# Altium schematic sheet 09-RF_SUBG.SchDoc
size C; SheetNumber: 9; SheetTotal: 12; SPICEModelCacheYEUHMWUF: <root> / <DocumentId>YEUHMWUF</DocumentId> / <CacheFrame Number="0"> / <Model Name="umk105bj104_v-f" Kind="CKT"> / <Text>* UMK105BJ104_V-F     SPICE MODEL  ( General Type ) / *-------------------------------------------------------------------------------------------------------- / * Model Generated by TAIYO YUDEN Corporation (http://www.ty-top.com) / * Version 1.0 / * TAIYO YUDEN Control No. 170508_120810 / * Copyright(c) 2012 TAIYO YUDEN CO.,LTD. All Rights Reserved. / *-------------------------------------------------------------------------------------------------------- / * / * Products Name : Multilayer Ceramic Capacitors / * / * Characteristics : / *     Capacitance : 0.1 uF , Rated Voltage : 50V , TCC : X5R / *     Case Size : 1.0 x 0.5 / 0.039 x 0.02 [mm/inch] , Thickness : 0.5 / 0.02 [mm/inch] / *     (Conditions: Temperature = 25 degC , DC Bias Current/Voltage = 0A / 0V) / * / * Frequency Range : 40Hz - 3GHz / * / * External Node Assignments : / * / *  1  o---| |---o  2 / * / *-------------------------------------------------------------------------------------------------------- / .SubCkt UMK105BJ104_V-F 1 2 / **************************** / C0 1 110 0.068998u / Cm 1 101 0.01292u / C1 101 102 0.041907u / Rc1 101 102 25.432k / C2 102 103 0.021417u / Rc2 102 103 1.1926k / C3 103 110 0.016759u / Rc3 103 110 12.415 / C2m 1 301 0.022631u / C21 301 302 0.1608u / Rc21 301 302 202.11k / C22 302 303 0.054305u / Rc22 302 303 87.274k / C23 303 304 0.14296u / Rc23 303 304 7.7387k / C24 304 305 0.08092u / Rc24 304 305 2.9339k / C25 305 306 0.04951u / Rc25 305 306 2.1733k / C26 306 307 0.043691u / Rc26 306 307 191.91 / C27 307 308 0.016759u / Rc27 307 308 147.23 / C28 308 309 5027.4p / Rc28 308 309 97.746 / C29 309 110 570.66p / Rc29 309 110 12.365 / Rp0 1 110 5G / L0 110 120 0.23341n / Lm 120 130 0.14222n / L1 120 121 0.036554n / RL1 121 130 1.698 / L2 120 122 0.11188n / RL2 122 130 0.33926 / L3 120 123 1.1401n / RL3 123 130 1.655 / CR 120 124 0.028892u / LR 124 125 0.10347n / RR 125 130 0.14446 / CL 130 140 2.048p / LL 130 140 0.1545n / RL 130 140 189.66 / Rs 140 2 26.069m / **************************** / .ends UMK105BJ104_V-F</Text> / </Model> / </CacheFrame> / </root>
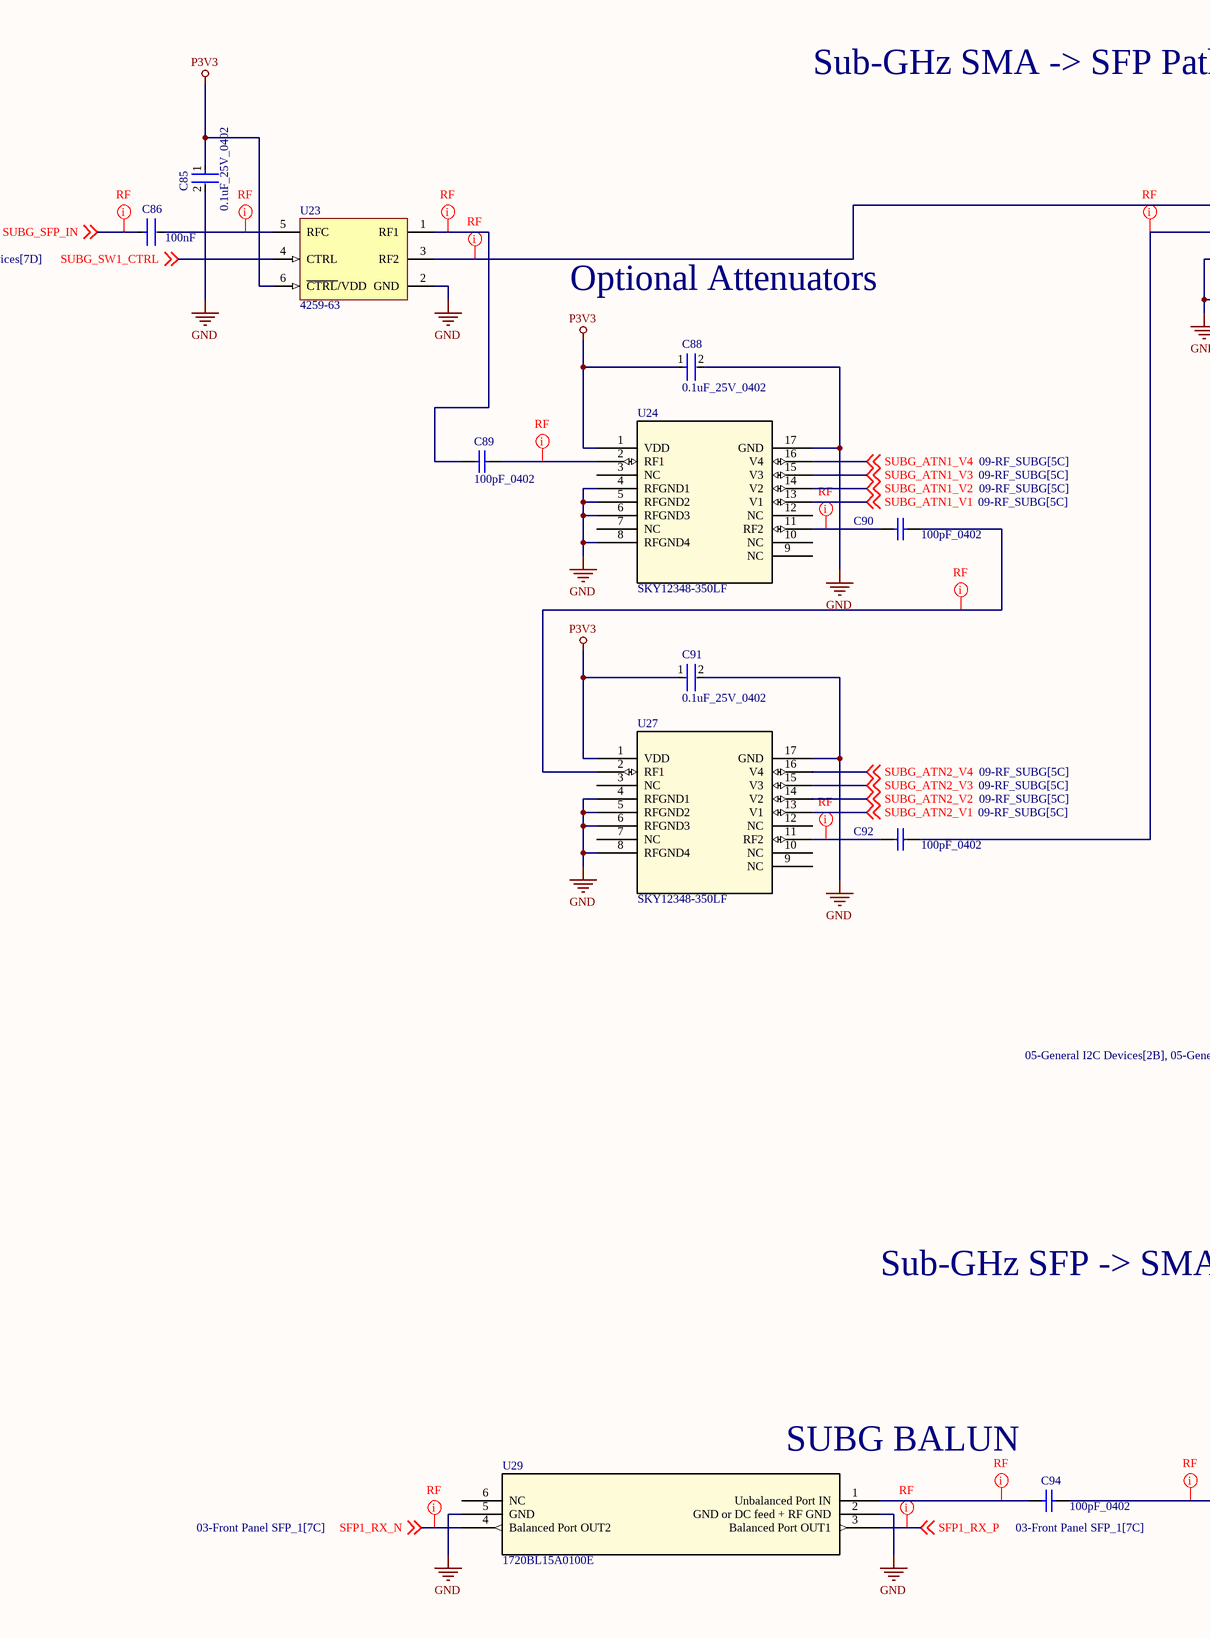
[diagram p0: 09-RF_SUBG.SchDoc, left]
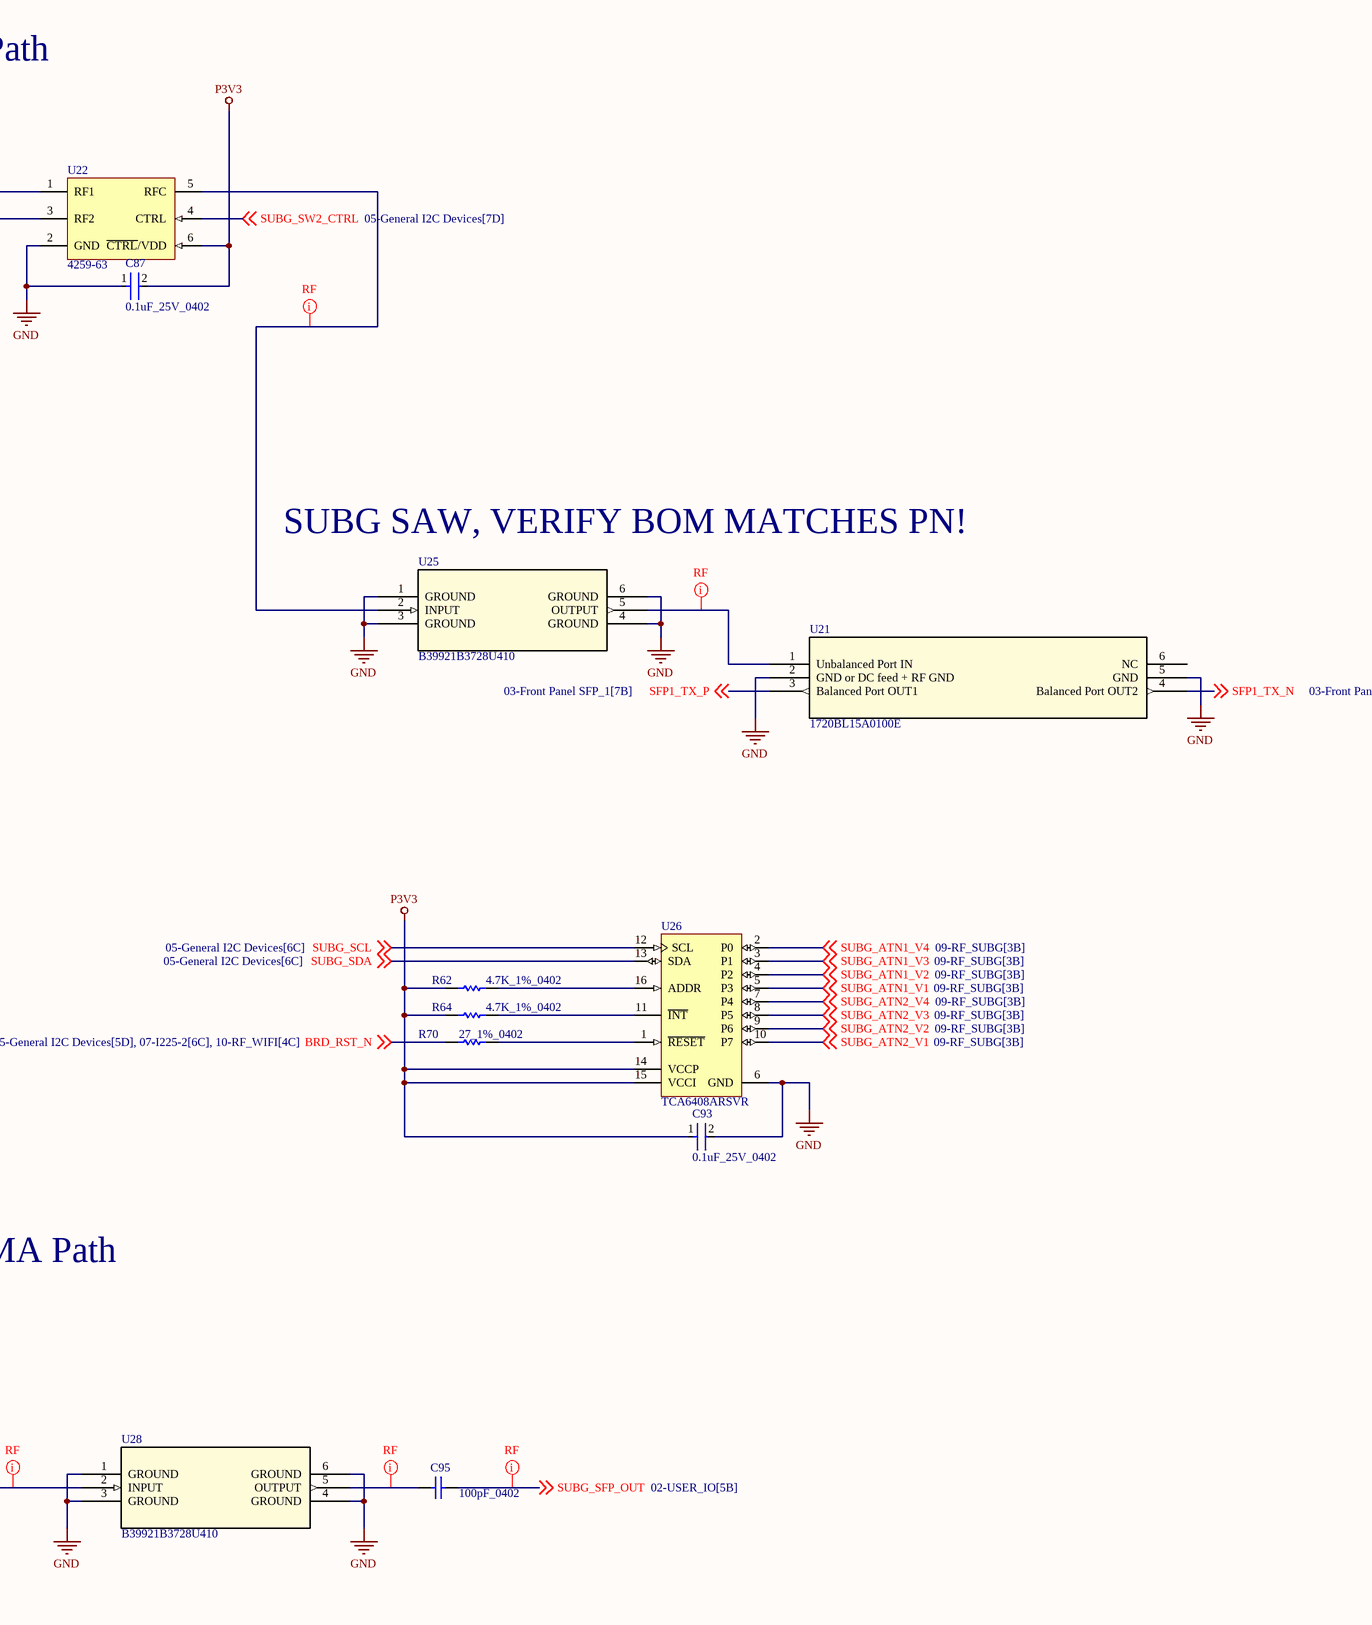
[diagram p1: 09-RF_SUBG.SchDoc, right]

## Parts
C85  0.1uF_25V_0402  [FP-0402-L_1_0_1-W_0_5_0_1-IPC_C]
C86  100nF  [FP-0402-L_1_0_0_05-W_0_5-IPC_B]
C87  0.1uF_25V_0402  [FP-0402-L_1_0_1-W_0_5_0_1-IPC_C]
C88  0.1uF_25V_0402  [FP-0402-L_1_0_1-W_0_5_0_1-IPC_C]
C89  100pF_0402  [CAPC1005X55X25ML05T10]
C90  100pF_0402  [CAPC1005X55X25ML05T10]
C91  0.1uF_25V_0402  [FP-0402-L_1_0_1-W_0_5_0_1-IPC_C]
C92  100pF_0402  [CAPC1005X55X25ML05T10]
C93  0.1uF_25V_0402  [FP-0402-L_1_0_1-W_0_5_0_1-IPC_C]
C94  100pF_0402  [CAPC1005X55X25ML05T10]
C95  100pF_0402  [CAPC1005X55X25ML05T10]
R62  4.7K_1%_0402  [RESC1005X40X25NL10T10]
R64  4.7K_1%_0402  [RESC1005X40X25NL10T10]
R70  27_1%_0402  [RESC1005X40X25NL05T05]
U21  1720BL15A0100E  [SMT_15B0050E_JOT]
U22  4259-63  [PERE-SC-70-6_M]
U23  4259-63  [PERE-SC-70-6_M]
U24  SKY12348-350LF  [SKY12348-350LF_SKY]
U25  B39921B3728U410  [B39162B3913U410_QUA]
U26  TCA6408ARSVR  [RSV0016A_V]
U27  SKY12348-350LF  [SKY12348-350LF_SKY]
U28  B39921B3728U410  [B39162B3913U410_QUA]
U29  1720BL15A0100E  [SMT_15B0050E_JOT]

## Nets
GND: C85.2 C87.1 C88.2 C91.2 C93.2 U21.2(GND_or_DC_feed_+_RF_GND) U21.5(GND) U22.2(GND) U23.2(GND) U24.4(RFGND1) U24.5(RFGND2) U24.6(RFGND3) U24.8(RFGND4) U24.17(GND) U25.1(GROUND) U25.3(GROUND) U25.4(GROUND) U25.6(GROUND) U26.6(GND) U27.4(RFGND1) U27.5(RFGND2) U27.6(RFGND3) U27.8(RFGND4) U27.17(GND) U28.1(GROUND) U28.3(GROUND) U28.4(GROUND) U28.6(GROUND) U29.2(GND_or_DC_feed_+_RF_GND) U29.5(GND)
P3V3: C85.1 C87.2 C88.1 C91.1 C93.1 R62.2 R64.2 U22.6(~{CTRL}/VDD) U23.6(~{CTRL}/VDD) U24.1(VDD) U26.14(VCCP) U26.15(VCCI) U27.1(VDD)
BRD_RST_N: R70.1 ; off-sheet BRD_RST_N
SFP1_RX_N: U29.4(Balanced_Port_OUT2) ; off-sheet SFP1_RX_N
SFP1_RX_P: U29.3(Balanced_Port_OUT1) ; off-sheet SFP1_RX_P
SFP1_TX_N: U21.4(Balanced_Port_OUT2) ; off-sheet SFP1_TX_N
SFP1_TX_P: U21.3(Balanced_Port_OUT1) ; off-sheet SFP1_TX_P
SUBG_ATN1_V1: U24.13(V1) U26.5(P3) ; off-sheet SUBG_ATN1_V1
SUBG_ATN1_V2: U24.14(V2) U26.4(P2) ; off-sheet SUBG_ATN1_V2
SUBG_ATN1_V3: U24.15(V3) U26.3(P1) ; off-sheet SUBG_ATN1_V3
SUBG_ATN1_V4: U24.16(V4) U26.2(P0) ; off-sheet SUBG_ATN1_V4
SUBG_ATN2_V1: U26.10(P7) U27.13(V1) ; off-sheet SUBG_ATN2_V1
SUBG_ATN2_V2: U26.9(P6) U27.14(V2) ; off-sheet SUBG_ATN2_V2
SUBG_ATN2_V3: U26.8(P5) U27.15(V3) ; off-sheet SUBG_ATN2_V3
SUBG_ATN2_V4: U26.7(P4) U27.16(V4) ; off-sheet SUBG_ATN2_V4
SUBG_SCL: U26.12(SCL) ; off-sheet SUBG_SCL
SUBG_SDA: U26.13(SDA) ; off-sheet SUBG_SDA
SUBG_SFP_IN: C86.1 ; off-sheet SUBG_SFP_IN
SUBG_SFP_OUT: C95.2 ; off-sheet SUBG_SFP_OUT
SUBG_SW1_CTRL: U23.4(CTRL) ; off-sheet SUBG_SW1_CTRL
SUBG_SW2_CTRL: U22.4(CTRL) ; off-sheet SUBG_SW2_CTRL
NetC86_2: C86.2 U23.5(RFC)
NetC89_1: C89.1 U23.1(RF1)
NetC89_2: C89.2 U24.2(RF1)
NetC90_1: C90.1 U24.11(RF2)
NetC90_2: C90.2 U27.2(RF1)
NetC92_1: C92.1 U27.11(RF2)
NetC92_2: C92.2 U22.3(RF2)
NetC94_1: C94.1 U29.1(Unbalanced_Port_IN)
NetC94_2: C94.2 U28.2(INPUT)
NetC95_1: C95.1 U28.5(OUTPUT)
NetR62_1: R62.1 U26.16(ADDR)
NetR64_1: R64.1 U26.11(~{INT})
NetR70_2: R70.2 U26.1(~{RESET})
NetU21_1: U21.1(Unbalanced_Port_IN) U25.5(OUTPUT)
NetU22_1: U22.1(RF1) U23.3(RF2)
NetU22_5: U22.5(RFC) U25.2(INPUT)

Not connected (* = marked no-connect by the designer): U21 6(NC); U24 3(NC) 7(NC) 9(NC) 10(NC) 12(NC); U27 3(NC) 7(NC) 9(NC) 10(NC) 12(NC); U29 6(NC)

## Layout directives
net class RF: NetC86_2, NetC89_1, NetC89_2, NetC90_1, NetC90_2, NetC92_1, NetC92_2, NetC94_1, NetC94_2, NetC95_1, NetU21_1, NetU22_1, NetU22_5, SFP1_RX_N, SFP1_RX_P, SUBG_SFP_IN, SUBG_SFP_OUT

## Notes on the sheet
- Sub-GHz SMA -> SFP Path
- Optional Attenuators
- SUBG SAW, VERIFY BOM MATCHES PN!
- Sub-GHz SFP -> SMA Path
- (near U29) SUBG BALUN

## Library data of the parts
C85 C87 C88 C91 C93 = CMP-2008-02519-2: General Purpose Ceramic Capacitor, 0402, 100nF, 10%, X7R, 15%, 25V; Package Quantity: 1; Capacitance: 100nF; Min Operating Temperature: -55°C; Voltage: 25V; Voltage Rating: 25V; Construction: Flat; Max Operating Temperature: 125°C; Radiation Hardening: No; Depth: 0.5mm; Thickness: 0.022inch; Voltage Rating (DC): 25V; Number of Pins: 2; Lead Free: Lead Free; Series: -; REACH SVHC: No SVHC; Length: 1mm; Dielectric: X7R; RoHS Compliant: Yes; Mount: Surface Mount; Packaging: Tape and Reel; Case/Package: 0402; Case Code (Imperial): 0402; Termination: SMD/SMT; Width: 0.02inch; Case Code (Metric): 1005; Tolerance: 10%
C86 = CMP-14477-000330-2: None; Voltage Rating (DC): 50V; Dielectric: X5R; Tolerance: 10%; RoHS Compliant: Yes; Termination: SMD/SMT; Packaging: Tape and Reel; Capacitance: 100nF; Height: 0.5mm; Halogen Free: Halogen Free; Case Code (Metric): 1005; Width: 0.02inch; Max Operating Temperature: 85°C; Voltage Rating: 50V; Min Operating Temperature: -55°C; Package Quantity: 10000; Case/Package: 0402; Case Code (Imperial): 0402; Length: 0.039inch; Thickness: 0.022inch; Mount: Surface Mount
C89 C90 C92 C94 C95 = CMP-2008-03915-1: Manufacturer: Murata; Part Number: GRM1555C1H101JA01D
R62 R64 = CMP-2002-05217-1: Manufacturer: Bourns; Part Number: CR0402-FX-4701GLF
R70 = CMP-2002-08434-1: Part Number: CRCW040227R0FKED; Manufacturer: Vishay Dale
U21 U29 = 1720BL15A0100E: No Description Available; Mfr_Name: Johanson Technology; RefDes: RefDes; Type: Type
U22 U23 = CMP-2000-05298-1: IC RF Switch SPDT, 50 Ohm, 6-Pin SC70, RoHS, Tape and Reel; Manufacturer: Peregrine Semiconductor; P1dB: 29dBm(typ)IP1dB; Topology: Reflective; Frequency - Upper: 3GHz; Insertion Loss @ Frequency: 0.5dB@2GHz; IIP3: 55dBm(typ); Voltage - Supply: 1.8V~3.3V; Other Names: 1046-1011-24259-63-ND425963PE4259PE4259SCBC-ZPE4259SCBC-Z-ND; Isolation @ Frequency: 20dB@2GHz(typ); Frequency - Lower: 10MHz; Online Catalog: PE4259; Impedance: 50Ohm; RF Type: GeneralPurpose; Series: UltraCMOS; Manufacturer URL: http://www.psemi.com/; Package Description: 6-Pin Small Outline Transistor, Body 2.05 x 1.25 mm, Pitch 0.65 mm; Family: RFSwitches; Packaging: Tape&Reel(TR); Features: Single/DualLineControl; Package / Case: 6-TSSOP,SC-88,SOT-363; Operating Temperature: -40degC~85degC; Circuit: SPDT; Supplier Device Package: SC-70-6; Standard Package: 3,000; Datasheet URL: https://datasheet.ciiva.com/15100/getdatasheetpartid-685660-15100501.pdf; Category: RF/IFandRFID; Datasheet Version: Jan-11; Package Reference: SC-70-6
U24 U27 = SKY12348-350LF: No Description Available; Mfr_Name: Skyworks; RefDes: RefDes; Type: Type
U25 U28 = B39162B3913U410: No Description Available; Mfr_Name: Qualcomm; RefDes: RefDes; Type: Type
U26 = CMP-0314-00021-2: Low-Voltage 8-Bit I2C and SMBus I/O Expander, 1.65 to 5.5 V, -40 to 85 degC, 16-pin UQFN (RSV), Green (RoHS & no Sb/Br); Manufacturer: Texas Instruments; Configuration Registers: Yes; Max Frequency(kHz): 400; # of I/Os: 8; SubFamily: I2C IO Expander; I2C Address: 0100 00x; VCC(Min)(V): 1.65; VCC(Max)(V): 5.5; Reset Input: Yes; ComponentLink2URL: http://www.ti.com/litv/pdf/mpqf115g; PackageVersion: revD, Dec-2011; No. of Outputs: 8; PackageReference: RSV0016A; DatasheetVersion: SCPS192C; fSCLK(Max)(MHz): 400; Mounting Technology: Surface Mount; ComponentLink1Description: Datasheet; Push-Pull I/O Type: Yes; Code_JEDEC: MO-288*; PackageDescription: 16-Leads Plastic Quad Flatpack No-Lead, 2.6 x 1.8 x 0.5 mm Body, 0.4 mm Pitch; ComponentLink1URL: http://www.ti.com/general/docs/lit/getliterature.tsp?genericPartNumber=TCA6408A&fileType=pdf; Interrupt Output: Yes; PartNumber: TCA6408ARSVR; Eco-Plan: Green (RoHS & no Sb/Br); Low Power: Yes; Vcc range(V): 1.65 to 5.5; ComponentLink2Description: Package Specification; 5V Tolerant I/O: Yes